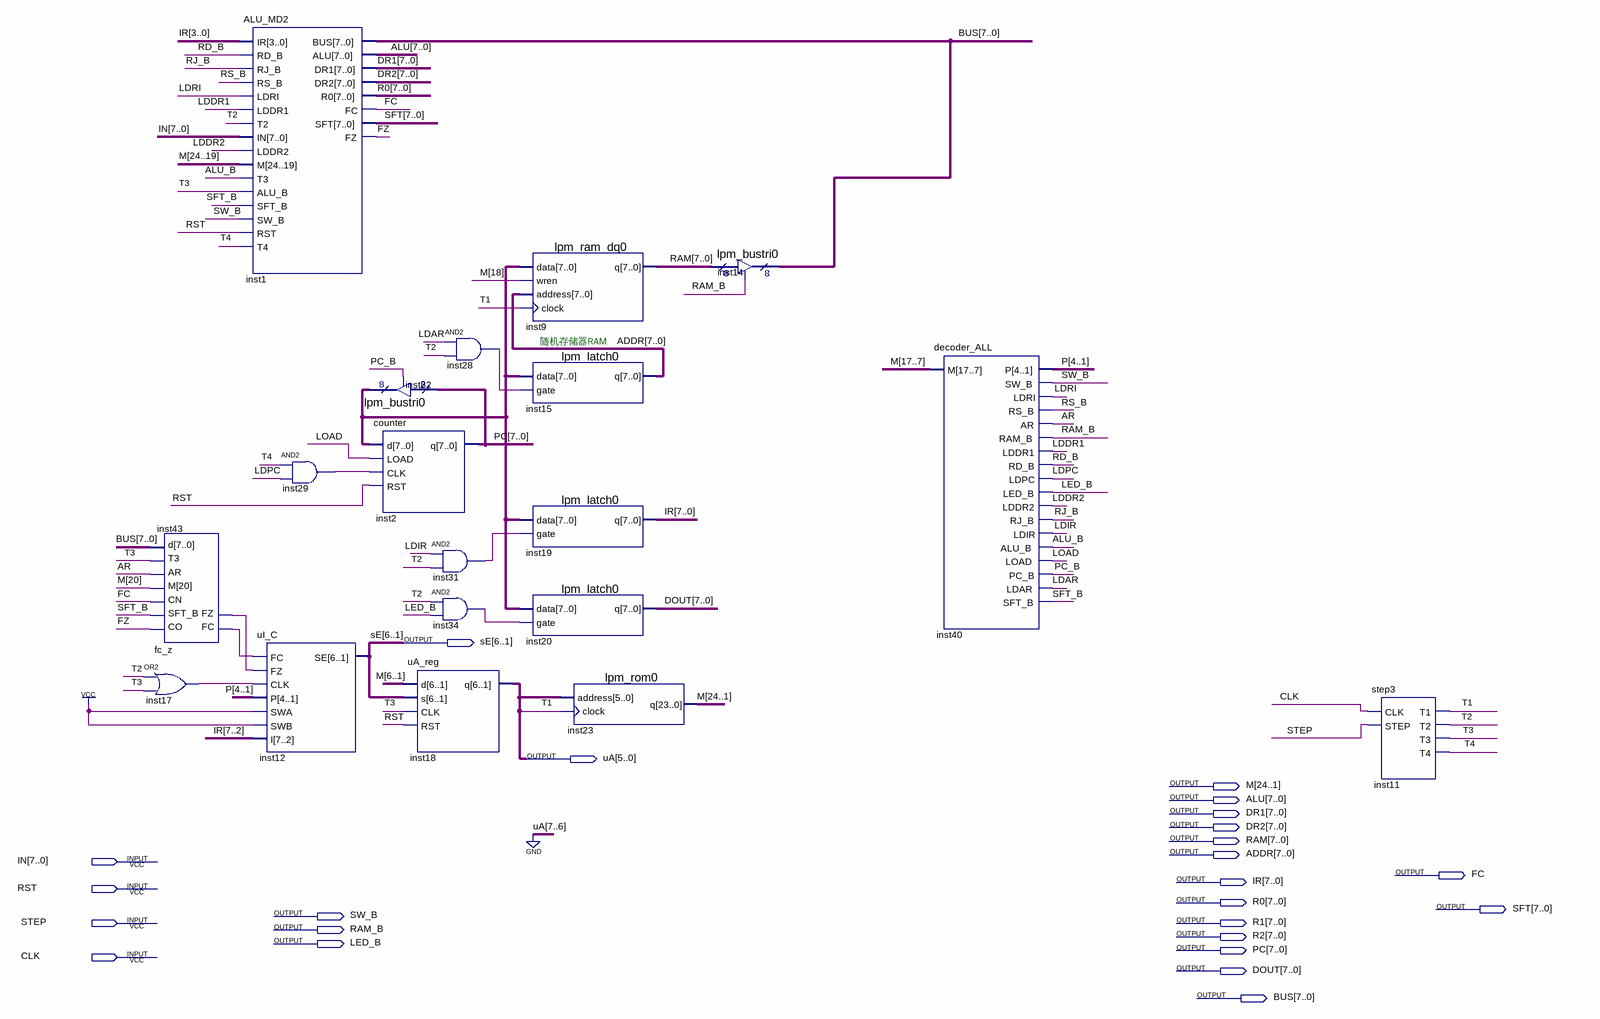
[diagram p0: schematic sheet]
// Quartus schematic CPU8.bdf as structural Verilog: 19 symbols, 24 pins
module CPU8 (
  input  [7:0] IN,
  input  RST,
  input  STEP,
  input  CLK,
  output [6:1] sE,
  output [5:0] uA,
  output [24:1] M,
  output [7:0] ALU,
  output [7:0] DR1,
  output [7:0] DR2,
  output [7:0] RAM,
  output [7:0] ADDR,
  output FC,
  output [7:0] IR,
  output [7:0] R0,
  output [7:0] SFT,
  output SW_B,
  output [7:0] R1,
  output RAM_B,
  output [7:0] R2,
  output LED_B,
  output [7:0] PC,
  output [7:0] DOUT,
  output [7:0] BUS
);

  wire ALU_B, AR, FZ, inst17_out, inst28_out, inst29_out, inst31_out, inst34_out, inst43_fc, inst43_fz, LDAR,
       LDDR1, LDDR2, LDIR, LDPC, LDRI, LOAD, PC_B, RD_B, RJ_B, RS_B, SFT_B, T1, T2, T3, T4;
  wire [4:1] P;
  wire [7:0] inst22_tridata;

  or inst17 (inst17_out, T2, T3);
  fc_z inst43 (.CO(FZ), .SFT_B(SFT_B), .CN(FC), .M(M[20]), .AR(AR), .T3(T3), .d(BUS), .FC(inst43_fc), .FZ(inst43_fz));
  ALU_MD2 inst1 (
    .IR(IR[3:0]), .RD_B(RD_B), .RJ_B(RJ_B), .RS_B(RS_B), .LDRI(LDRI), .LDDR1(LDDR1), .T2(T2), .IN(IN),
    .LDDR2(LDDR2), .M(M[24:19]), .T3(ALU_B), .ALU_B(T3), .SFT_B(SFT_B), .SW_B(SW_B), .RST(RST), .T4(T4),
    .ALU(ALU), .DR1(DR1), .DR2(DR2), .R0(R0), .FC(FC), .SFT(SFT), .FZ(FZ), .BUS(BUS));
  uI_C inst12 (.FC(inst43_fc), .FZ(inst43_fz), .CLK(inst17_out), .P(P), .SWA(1'b1), .SWB(1'b1), .I(IR[7:2]), .SE(sE));
  and inst29 (inst29_out, T4, LDPC);
  lpm_bustri0 inst22 (.enabledt(PC_B), .data(PC), .tridata(inst22_tridata));
  counter inst2 (.d(inst22_tridata), .LOAD(LOAD), .CLK(inst29_out), .RST(RST), .q(PC));
  uA_reg inst18 (.d(M[6:1]), .s(sE), .CLK(T3), .RST(RST), .q(uA));
  and inst28 (inst28_out, LDAR, T2);
  and inst31 (inst31_out, LDIR, T2);
  and inst34 (inst34_out, T2, LED_B);
  lpm_ram_dq0 inst9 (.data(inst22_tridata), .wren(M[18]), .address(ADDR), .clock(T1), .q(RAM));
  lpm_latch0 inst15 (.data(inst22_tridata), .gate(inst28_out), .q(ADDR));
  lpm_latch0 inst19 (.data(inst22_tridata), .gate(inst31_out), .q(IR));
  lpm_latch0 inst20 (.data(inst22_tridata), .gate(inst34_out), .q(DOUT));
  lpm_rom0 inst23 (.address(uA), .clock(T1), .q(M));
  lpm_bustri0 inst14 (.enabledt(RAM_B), .data(RAM), .tridata(BUS));
  decoder_ALL inst40 (
    .M(M[17:7]), .P(P), .SW_B(SW_B), .LDRI(LDRI), .RS_B(RS_B), .AR(AR), .RAM_B(RAM_B), .LDDR1(LDDR1),
    .RD_B(RD_B), .LDPC(LDPC), .LED_B(LED_B), .LDDR2(LDDR2), .RJ_B(RJ_B), .LDIR(LDIR), .ALU_B(ALU_B),
    .LOAD(LOAD), .PC_B(PC_B), .LDAR(LDAR), .SFT_B(SFT_B));
  step3 inst11 (.CLK(CLK), .STEP(STEP), .T1(T1), .T2(T2), .T3(T3), .T4(T4));

  // Notes on the sheet:
  //   随机存储器RAM
endmodule
